# EAGLE board axiom_beta_main_board_v0.29_test (EAGLE 7.0.0), part 1 of 3
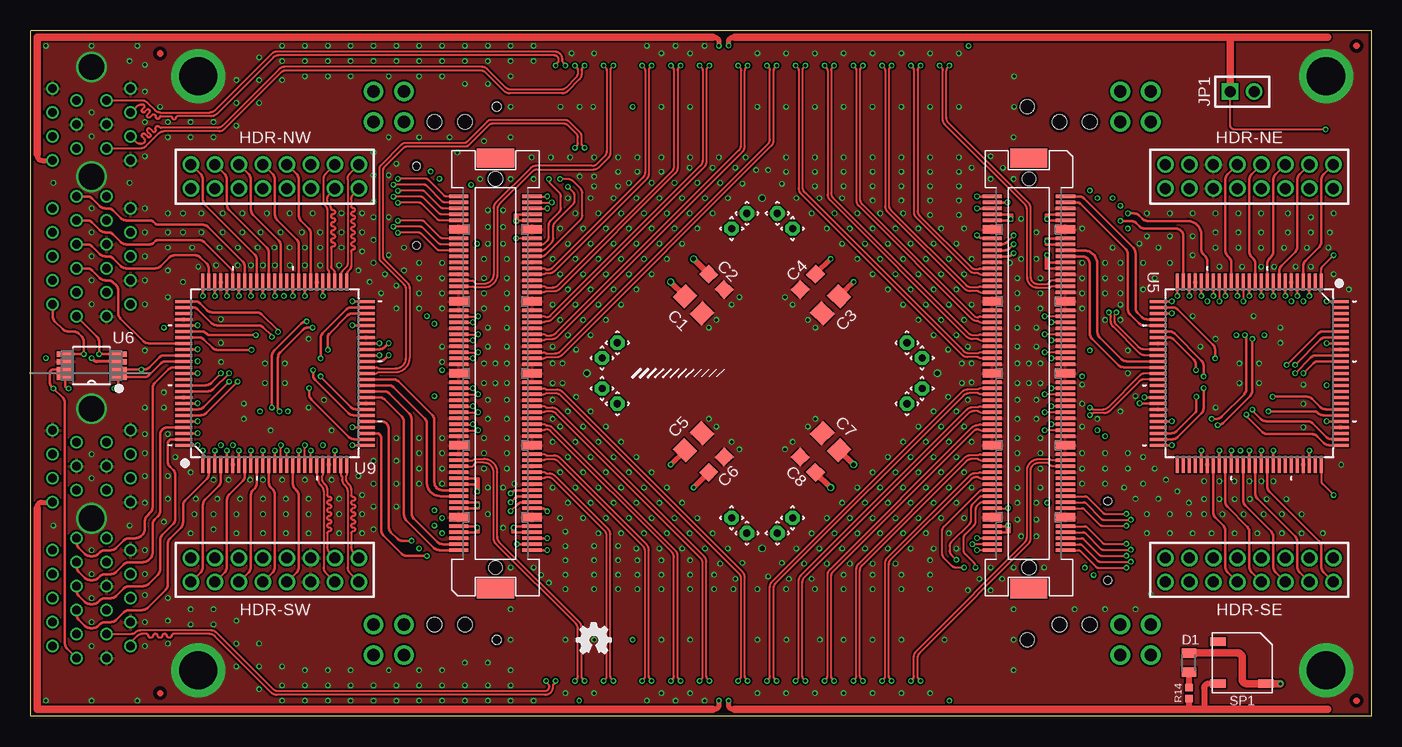
[diagram p6: board, top side]
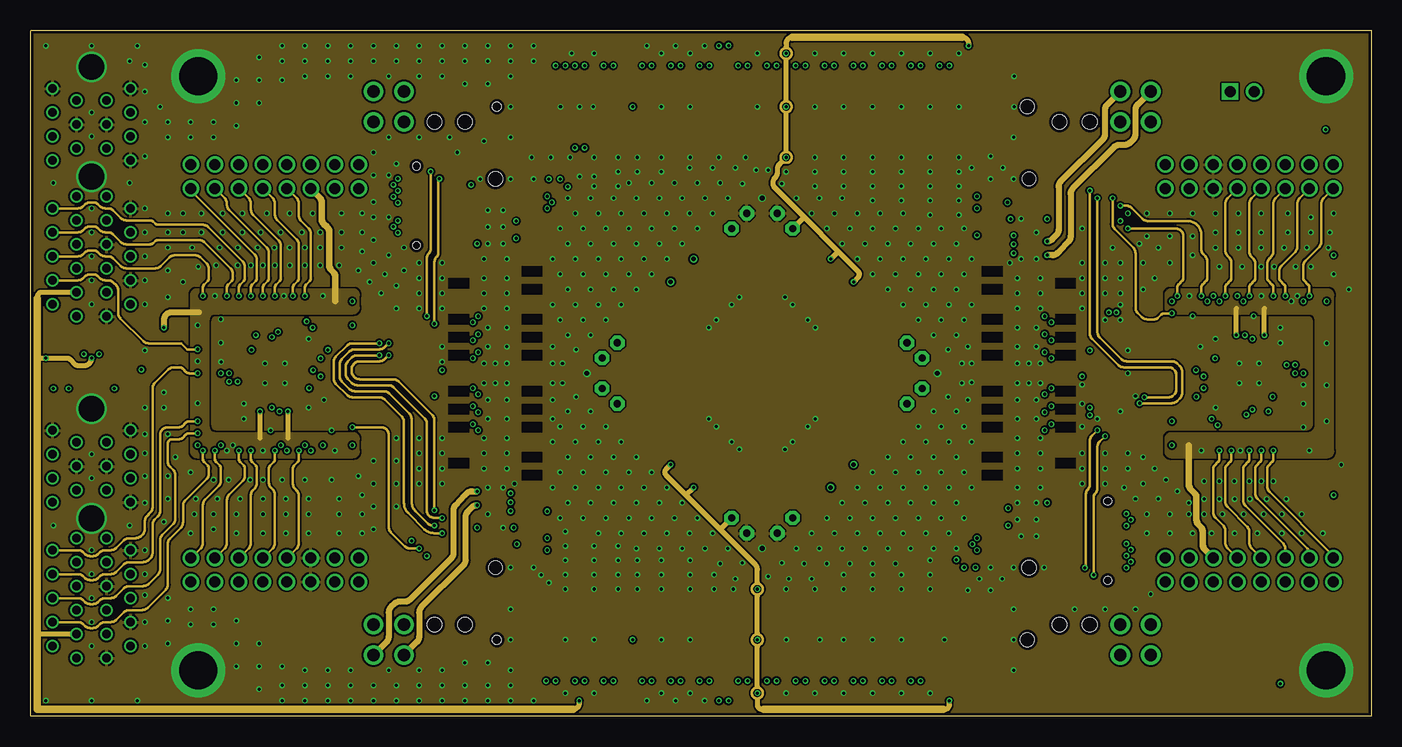
[diagram p7: board, inner layer Route2]
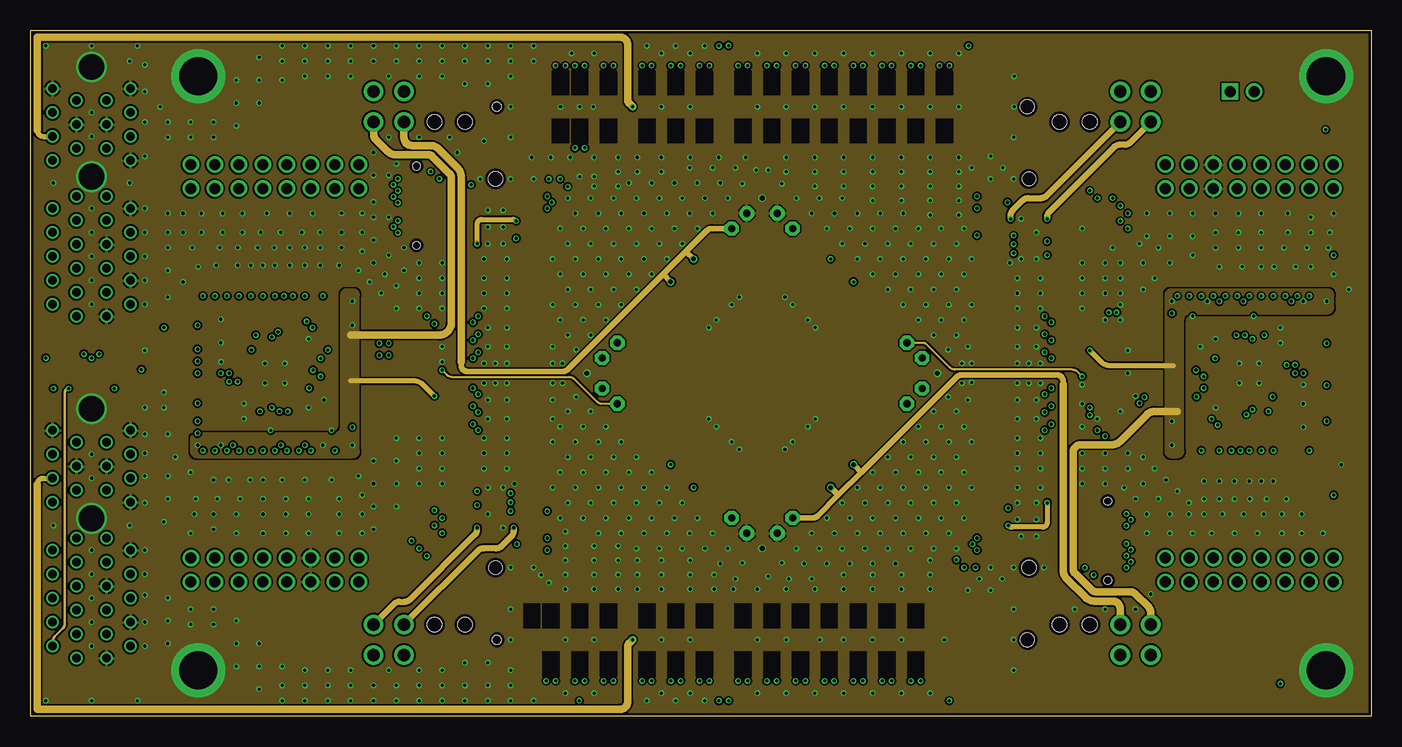
[diagram p8: board, inner layer Route15]
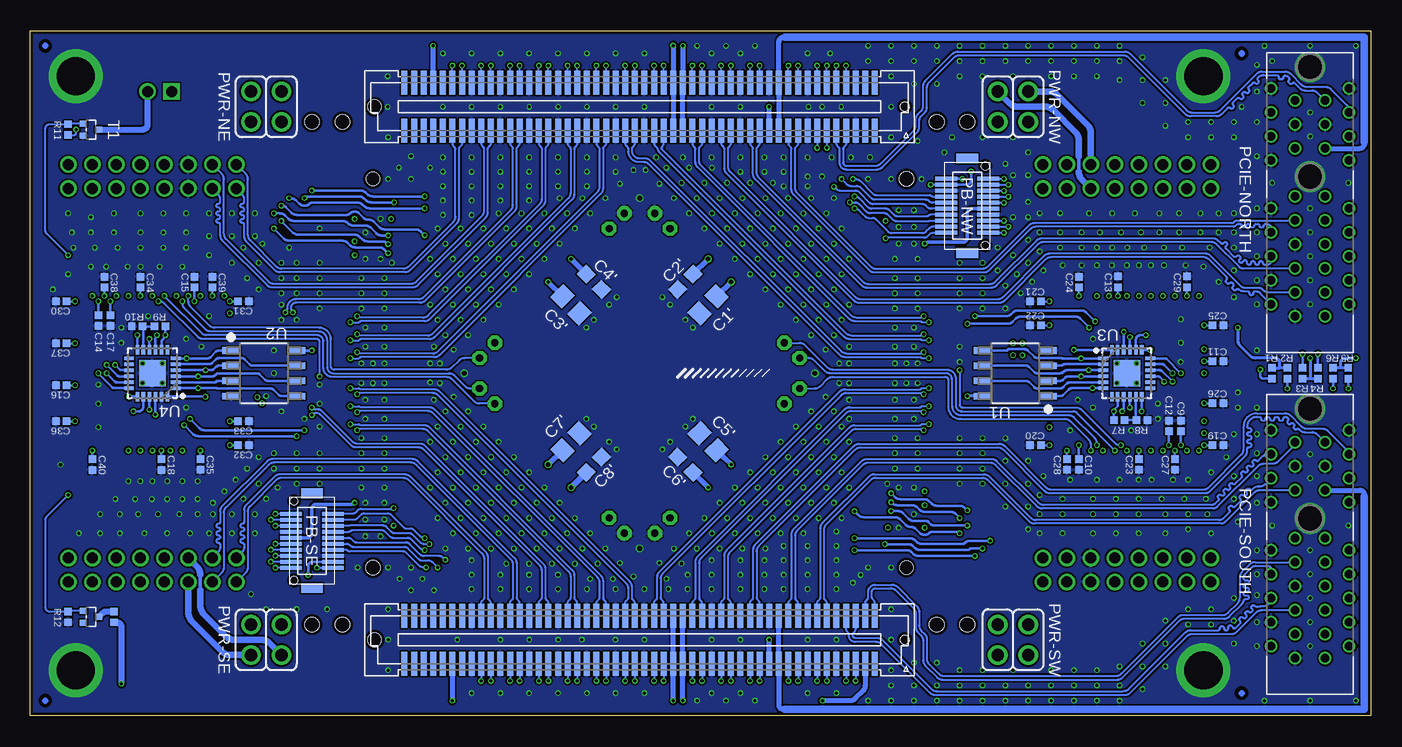
[diagram p9: board, bottom side, seen from below]

Size 111.76 x 57.15 mm. Coordinates in mm from the lower left corner, seen from the top.
Outline: 111.76,57.15 0,57.15 0,0 111.76,0 111.76,57.15
Copper layers (1*2*15*16): Top 0.035559375mm / dielectric 0.17018125mm / Route2 0.01778125mm / dielectric 47mil / Route15 0.01778125mm / dielectric 0.17018125mm / Bottom 0.035559375mm
Design rules "OSHPark-4layer-tuned *": minimum track width 5mil, minimum drill 10mil, track to track 6mil, track to pad 5mil, pad to pad 5mil, via to via 5mil, smd to smd 5mil, copper to edge 10mil, drill to drill 6mil, minimum pad ring 4mil, minimum via ring 4mil, stop-mask expansion 2mil, vias tented up to drill 100mil, thermal gap 6mil
Net classes: 0 default: width 0.152 mm, drill 0.254 mm; 1 power: width 0.152 mm, drill 0.254 mm
Holes 1.2 mm at 33.66,49.53 36.2,49.53 85.72,49.53 88.27,49.53 33.66,7.62 36.2,7.62 85.72,7.62 88.27,7.62
tKeepout: area 105.5,50.8 to 110.5,55.8; area 105.5,1.3 to 110.5,6.3; area 11.5,1.3 to 16.5,6.3; area 11.5,50.8 to 16.5,55.8; area 44.8,12.4 to 77.1,44.7
bKeepout: area 105.5,50.8 to 110.5,55.8; area 105.5,1.3 to 110.5,6.3; area 11.5,1.3 to 16.5,6.3; area 11.5,50.8 to 16.5,55.8
tRestrict: area 10.2,1.3 to 11.4,2.5; area 10.2,54.7 to 11.4,55.8; area 109.9,0.7 to 111,1.8; area 109.9,55.3 to 111,56.4
bRestrict: area 10.2,1.3 to 11.4,2.5; area 10.2,54.7 to 11.4,55.8; area 109.9,0.7 to 111,1.8; area 109.9,55.3 to 111,56.4

## Footprints (pad centres in the part's own frame; a part is rotated, then mirrored left to right if it is on the bottom)
0805-A = smd 1.35 x 1.55: 1 -1,0; 2 1,0
0603-A = smd 1.15 x 1.1: 1 -0.9,0; 2 0.9,0
0402-B = smd 0.62 x 0.62: 1 -0.45,0; 2 0.45,0
MICROMELF-R = smd 0.8 x 1.2: A 0.8,0; C -0.8,0
2X08M = drill 0.914: 1 -7,-1; 2 -7,1; 3 -5,-1; 4 -5,1; 5 -3,-1; 6 -3,1; 7 -1,-1; 8 -1,1; 9 1,-1; 10 1,1; 11 3,-1; 12 3,1; 13 5,-1; 14 5,1; 15 7,-1; 16 7,1
1X02M = drill 0.914 square: 1 -1,0 | drill 0.914: 2 1,0
DF12(XX)-20DP-0.5V = smd 1.8 x 0.35: 1 -1.75,2.25; 2 1.75,2.25; 3 -1.75,1.75; 4 1.75,1.75; 5 -1.75,1.25; 6 1.75,1.25; 7 -1.75,0.75; 8 1.75,0.75; 9 -1.75,0.25; 10 1.75,0.25; 11 -1.75,-0.25; 12 1.75,-0.25; 13 -1.75,-0.75; 14 1.75,-0.75; 15 -1.75,-1.25; 16 1.75,-1.25; 17 -1.75,-1.75; 18 1.75,-1.75; 19 -1.75,-2.25; 20 1.75,-2.25 | smd 1.8 x 0.8: M1 0,3.95; M2 0,-3.95 | hole 0.625: 1.5,-3.3; 1.5,3.3
PCIE-36-NOPEG = drill 0.7: A1 -11.65,1.25; A2 -10.65,3.25; A3 -9.65,1.25; A4 -8.65,3.25; A5 -7.65,1.25; A6 -6.65,3.25; A7 -5.65,1.25; A8 -4.65,3.25; A9 -3.65,1.25; A10 -2.65,3.25; A11 -1.65,1.25; A12 1.35,3.25; A13 2.35,1.25; A14 3.35,3.25; A15 4.35,1.25; A16 5.35,3.25; A17 6.35,1.25; A18 7.35,3.25; B1 -11.65,-1.25; B2 -10.65,-3.25; B3 -9.65,-1.25; B4 -8.65,-3.25; B5 -7.65,-1.25; B6 -6.65,-3.25; B7 -5.65,-1.25; B8 -4.65,-3.25; B9 -3.65,-1.25; B10 -2.65,-3.25; B11 -1.65,-1.25; B12 1.35,-3.25; B13 2.35,-1.25; B14 3.35,-3.25; B15 4.35,-1.25; B16 5.35,-3.25; B17 6.35,-1.25; B18 7.35,-3.25
2X02 = drill 1.016 pad 1.651: 1 -1.27,-1.27; 2 -1.27,1.27; 3 1.27,-1.27; 4 1.27,1.27
KSSG23J12 = smd 1.3 x 0.7: 1 -2,-1.75; 2 2,-1.75; 3 -2,1.75
SOT416 = smd 0.5 x 0.6: 1 -0.5,-0.65; 2 0.5,-0.65; 3 0,0.65
SOIC127P600X175-8N = smd 1.473 x 0.559: 1 -2.718,1.905; 2 -2.718,0.635; 3 -2.718,-0.635; 4 -2.718,-1.905; 5 2.718,-1.905; 6 2.718,-0.635; 7 2.718,0.635; 8 2.718,1.905
QFN50P400X400X80-25N = smd 0.813 x 0.305: 1 -1.956,1.245; 2 -1.956,0.762; 3 -1.956,0.254; 4 -1.956,-0.254; 5 -1.956,-0.762; 6 -1.956,-1.245; 13 1.956,-1.245; 14 1.956,-0.762; 15 1.956,-0.254; 16 1.956,0.254; 17 1.956,0.762; 18 1.956,1.245 | smd 0.305 x 0.813: 7 -1.245,-1.956; 8 -0.762,-1.956; 9 -0.254,-1.956; 10 0.254,-1.956; 11 0.762,-1.956; 12 1.245,-1.956; 19 1.245,1.956; 20 0.762,1.956; 21 0.254,1.956; 22 -0.254,1.956; 23 -0.762,1.956; 24 -1.245,1.956 | smd 2.21 x 2.21: 25 0,0
MACHXO2-100TQFP = smd 1.4 x 0.25: 1 -7.6,6; 2 -7.6,5.5; 3 -7.6,5; 4 -7.6,4.5; 5 -7.6,4; 6 -7.6,3.5; 7 -7.6,3; 8 -7.6,2.5; 9 -7.6,2; 10 -7.6,1.5; 11 -7.6,1; 12 -7.6,0.5; 13 -7.6,0; 14 -7.6,-0.5; 15 -7.6,-1; 16 -7.6,-1.5; 17 -7.6,-2; 18 -7.6,-2.5; 19 -7.6,-3; 20 -7.6,-3.5; 21 -7.6,-4; 22 -7.6,-4.5; 23 -7.6,-5; 24 -7.6,-5.5; 25 -7.6,-6; 51 7.6,-6; 52 7.6,-5.5; 53 7.6,-5; 54 7.6,-4.5; 55 7.6,-4; 56 7.6,-3.5; 57 7.6,-3; 58 7.6,-2.5; 59 7.6,-2; 60 7.6,-1.5; 61 7.6,-1; 62 7.6,-0.5; 63 7.6,0; 64 7.6,0.5; 65 7.6,1; 66 7.6,1.5; 67 7.6,2; 68 7.6,2.5; 69 7.6,3; 70 7.6,3.5; 71 7.6,4; 72 7.6,4.5; 73 7.6,5; 74 7.6,5.5; 75 7.6,6 | smd 0.25 x 1.4: 26 -6,-7.6; 27 -5.5,-7.6; 28 -5,-7.6; 29 -4.5,-7.6; 30 -4,-7.6; 31 -3.5,-7.6; 32 -3,-7.6; 33 -2.5,-7.6; 34 -2,-7.6; 35 -1.5,-7.6; 36 -1,-7.6; 37 -0.5,-7.6; 38 0,-7.6; 39 0.5,-7.6; 40 1,-7.6; 41 1.5,-7.6; 42 2,-7.6; 43 2.5,-7.6; 44 3,-7.6; 45 3.5,-7.6; 46 4,-7.6; 47 4.5,-7.6; 48 5,-7.6; 49 5.5,-7.6; 50 6,-7.6; 76 6,7.6; 77 5.5,7.6; 78 5,7.6; 79 4.5,7.6; 80 4,7.6; 81 3.5,7.6; 82 3,7.6; 83 2.5,7.6; 84 2,7.6; 85 1.5,7.6; 86 1,7.6; 87 0.5,7.6; 88 0,7.6; 89 -0.5,7.6; 90 -1,7.6; 91 -1.5,7.6; 92 -2,7.6; 93 -2.5,7.6; 94 -3,7.6; 95 -3.5,7.6; 96 -4,7.6; 97 -4.5,7.6; 98 -5,7.6; 99 -5.5,7.6; 100 -6,7.6
SOP65P490X110-8N = smd 1.422 x 0.457: 1 -2.21,0.965; 2 -2.21,0.33; 3 -2.21,-0.33; 4 -2.21,-0.965; 5 2.21,-0.965; 6 2.21,-0.33; 7 2.21,0.33; 8 2.21,0.965
1.2/0.6 = drill 0.6 pad 1.2 octagon: 1 0,0
FX10A-100S/10 = smd 0.3 x 1.6: 1 -14.75,3.05; 2 -14.75,-3.05; 3 -14.25,3.05; 4 -14.25,-3.05; 5 -13.75,3.05; 6 -13.75,-3.05; 7 -13.25,3.05; 8 -13.25,-3.05; 9 -12.75,3.05; 10 -12.75,-3.05; 11 -11.25,3.05; 12 -11.25,-3.05; 13 -10.75,3.05; 14 -10.75,-3.05; 15 -10.25,3.05; 16 -10.25,-3.05; 17 -9.75,3.05; 18 -9.75,-3.05; 19 -9.25,3.05; 20 -9.25,-3.05; 21 -8.75,3.05; 22 -8.75,-3.05; 23 -8.25,3.05; 24 -8.25,-3.05; 25 -7.75,3.05; 26 -7.75,-3.05; 27 -7.25,3.05; 28 -7.25,-3.05; 29 -6.75,3.05; 30 -6.75,-3.05; 31 -5.25,3.05; 32 -5.25,-3.05; 33 -4.75,3.05; 34 -4.75,-3.05; 35 -4.25,3.05; 36 -4.25,-3.05; 37 -3.75,3.05; 38 -3.75,-3.05; 39 -3.25,3.05; 40 -3.25,-3.05; 41 -2.75,3.05; 42 -2.75,-3.05; 43 -2.25,3.05; 44 -2.25,-3.05; 45 -1.75,3.05; 46 -1.75,-3.05; 47 -1.25,3.05; 48 -1.25,-3.05; 49 -0.75,3.05; 50 -0.75,-3.05; 51 0.75,3.05; 52 0.75,-3.05; 53 1.25,3.05; 54 1.25,-3.05; 55 1.75,3.05; 56 1.75,-3.05; 57 2.25,3.05; 58 2.25,-3.05; 59 2.75,3.05; 60 2.75,-3.05; 61 3.25,3.05; 62 3.25,-3.05; 63 3.75,3.05; 64 3.75,-3.05; 65 4.25,3.05; 66 4.25,-3.05; 67 4.75,3.05; 68 4.75,-3.05; 69 5.25,3.05; 70 5.25,-3.05; 71 6.75,3.05; 72 6.75,-3.05; 73 7.25,3.05; 74 7.25,-3.05; 75 7.75,3.05; 76 7.75,-3.05; 77 8.25,3.05; 78 8.25,-3.05; 79 8.75,3.05; 80 8.75,-3.05; 81 9.25,3.05; 82 9.25,-3.05; 83 9.75,3.05; 84 9.75,-3.05; 85 10.25,3.05; 86 10.25,-3.05; 87 10.75,3.05; 88 10.75,-3.05; 89 11.25,3.05; 90 11.25,-3.05; 91 12.75,3.05; 92 12.75,-3.05; 93 13.25,3.05; 94 13.25,-3.05; 95 13.75,3.05; 96 13.75,-3.05; 97 14.25,3.05; 98 14.25,-3.05; 99 14.75,3.05; 100 14.75,-3.05 | smd 0.7 x 1.6: G1 -12,3.05; G2 -12,-3.05; G3 -6,3.05; G4 -6,-3.05; G5 0,3.05; G6 0,-3.05; G7 6,3.05; G8 6,-3.05; G9 12,3.05; G10 12,-3.05 | smd 1.6 x 3.1: M1 -17.95,0; M2 17.95,0 | hole 1.1: -16.2,0 | hole 1.2: 16.2,0
µZ-NOHOLES-R = smd 0.5 x 2: 1 19.6,-24.226; 2 19.6,-20.226; 3 18.8,-24.226; 4 18.8,-20.226; 5 18,-24.226; 6 18,-20.226; 7 17.2,-24.226; 8 17.2,-20.226; 9 16.4,-24.226; 10 16.4,-20.226; 11 15.6,-24.226; 12 15.6,-20.226; 13 14.8,-24.226; 14 14.8,-20.226; 15 14,-24.226; 16 14,-20.226; 17 13.2,-24.226; 18 13.2,-20.226; 19 12.4,-24.226; 20 12.4,-20.226; 21 11.6,-24.226; 22 11.6,-20.226; 23 10.8,-24.226; 24 10.8,-20.226; 25 10,-24.226; 26 10,-20.226; 27 9.2,-24.226; 28 9.2,-20.226; 29 8.4,-24.226; 30 8.4,-20.226; 31 7.6,-24.226; 32 7.6,-20.226; 33 6.8,-24.226; 34 6.8,-20.226; 35 6,-24.226; 36 6,-20.226; 37 5.2,-24.226; 38 5.2,-20.226; 39 4.4,-24.226; 40 4.4,-20.226; 41 3.6,-24.226; 42 3.6,-20.226; 43 2.8,-24.226; 44 2.8,-20.226; 45 2,-24.226; 46 2,-20.226; 47 1.2,-24.226; 48 1.2,-20.226; 49 0.4,-24.226; 50 0.4,-20.226; 51 -0.4,-24.226; 52 -0.4,-20.226; 53 -1.2,-24.226; 54 -1.2,-20.226; 55 -2,-24.226; 56 -2,-20.226; 57 -2.8,-24.226; 58 -2.8,-20.226; 59 -3.6,-24.226; 60 -3.6,-20.226; 61 -4.4,-24.226; 62 -4.4,-20.226; 63 -5.2,-24.226; 64 -5.2,-20.226; 65 -6,-24.226; 66 -6,-20.226; 67 -6.8,-24.226; 68 -6.8,-20.226; 69 -7.6,-24.226; 70 -7.6,-20.226; 71 -8.4,-24.226; 72 -8.4,-20.226; 73 -9.2,-24.226; 74 -9.2,-20.226; 75 -10,-24.226; 76 -10,-20.226; 77 -10.8,-24.226; 78 -10.8,-20.226; 79 -11.6,-24.226; 80 -11.6,-20.226; 81 -12.4,-24.226; 82 -12.4,-20.226; 83 -13.2,-24.226; 84 -13.2,-20.226; 85 -14,-24.226; 86 -14,-20.226; 87 -14.8,-24.226; 88 -14.8,-20.226; 89 -15.6,-24.226; 90 -15.6,-20.226; 91 -16.4,-24.226; 92 -16.4,-20.226; 93 -17.2,-24.226; 94 -17.2,-20.226; 95 -18,-24.226; 96 -18,-20.226; 97 -18.8,-24.226; 98 -18.8,-20.226; 99 -19.6,-24.226; 100 -19.6,-20.226; 101 19.6,20.226; 102 19.6,24.226; 103 18.8,20.226; 104 18.8,24.226; 105 18,20.226; 106 18,24.226; 107 17.2,20.226; 108 17.2,24.226; 109 16.4,20.226; 110 16.4,24.226; 111 15.6,20.226; 112 15.6,24.226; 113 14.8,20.226; 114 14.8,24.226; 115 14,20.226; 116 14,24.226; 117 13.2,20.226; 118 13.2,24.226; 119 12.4,20.226; 120 12.4,24.226; 121 11.6,20.226; 122 11.6,24.226; 123 10.8,20.226; 124 10.8,24.226; 125 10,20.226; 126 10,24.226; 127 9.2,20.226; 128 9.2,24.226; 129 8.4,20.226; 130 8.4,24.226; 131 7.6,20.226; 132 7.6,24.226; 133 6.8,20.226; 134 6.8,24.226; 135 6,20.226; 136 6,24.226; 137 5.2,20.226; 138 5.2,24.226; 139 4.4,20.226; 140 4.4,24.226; 141 3.6,20.226; 142 3.6,24.226; 143 2.8,20.226; 144 2.8,24.226; 145 2,20.226; 146 2,24.226; 147 1.2,20.226; 148 1.2,24.226; 149 0.4,20.226; 150 0.4,24.226; 151 -0.4,20.226; 152 -0.4,24.226; 153 -1.2,20.226; 154 -1.2,24.226; 155 -2,20.226; 156 -2,24.226; 157 -2.8,20.226; 158 -2.8,24.226; 159 -3.6,20.226; 160 -3.6,24.226; 161 -4.4,20.226; 162 -4.4,24.226; 163 -5.2,20.226; 164 -5.2,24.226; 165 -6,20.226; 166 -6,24.226; 167 -6.8,20.226; 168 -6.8,24.226; 169 -7.6,20.226; 170 -7.6,24.226; 171 -8.4,20.226; 172 -8.4,24.226; 173 -9.2,20.226; 174 -9.2,24.226; 175 -10,20.226; 176 -10,24.226; 177 -10.8,20.226; 178 -10.8,24.226; 179 -11.6,20.226; 180 -11.6,24.226; 181 -12.4,20.226; 182 -12.4,24.226; 183 -13.2,20.226; 184 -13.2,24.226; 185 -14,20.226; 186 -14,24.226; 187 -14.8,20.226; 188 -14.8,24.226; 189 -15.6,20.226; 190 -15.6,24.226; 191 -16.4,20.226; 192 -16.4,24.226; 193 -17.2,20.226; 194 -17.2,24.226; 195 -18,20.226; 196 -18,24.226; 197 -18.8,20.226; 198 -18.8,24.226; 199 -19.6,20.226; 200 -19.6,24.226 | hole 1.125: 22.1,-22.225; 22.1,22.225 | hole 0.725: -22.1,-22.225; -22.1,22.225

## Placement (x,y rotation side)
C1  [0805-A]  55.25,34.29 315 top
C1'  [0805-A]  55.25,34.29 225 bottom
C2  [0603-A]  57.15,36.2 315 top
C2'  [0603-A]  57.15,36.2 225 bottom
C3  [0805-A]  66.67,34.29 225 top
C3'  [0805-A]  66.67,34.29 315 bottom
C4  [0603-A]  64.77,36.2 225 top
C4'  [0603-A]  64.77,36.2 315 bottom
C5  [0805-A]  55.25,22.86 45 top
C5'  [0805-A]  55.25,22.86 135 bottom
C6  [0603-A]  57.15,20.95 45 top
C6'  [0603-A]  57.15,20.95 135 bottom
C7  [0805-A]  66.67,22.86 135 top
C7'  [0805-A]  66.67,22.86 45 bottom
C8  [0603-A]  64.77,20.95 135 top
C8'  [0603-A]  64.77,20.95 45 bottom
C9  100n  [0402-B]  15.86,24.17 90 bottom
C10  100n  [0402-B]  24.36,20.98 270 bottom
C11  100n  [0402-B]  12.76,29.57 0 bottom
C12  100n  [0402-B]  16.86,24.17 90 bottom
C13  100n  [0402-B]  21.11,36.2 90 bottom
C14  100n  [0402-B]  106.06,32.98 270 bottom
C15  100n  [0402-B]  98.06,36.17 90 bottom
C16  100n  [0402-B]  109.16,27.57 180 bottom
C17  100n  [0402-B]  105.06,32.98 270 bottom
C18  100n  [0402-B]  100.81,20.95 270 bottom
C19  10n  [0402-B]  12.76,22.57 0 bottom
C20  10n  [0402-B]  27.96,22.57 180 bottom
C21  10n  [0402-B]  27.96,34.58 180 bottom
C22  10n  [0402-B]  27.96,32.58 180 bottom
C23  10n  [0402-B]  19.36,20.98 270 bottom
C24  10n  [0402-B]  24.36,36.18 90 bottom
C25  10n  [0402-B]  12.76,32.58 0 bottom
C26  10n  [0402-B]  12.76,26.07 0 bottom
C27  10n  [0402-B]  16.36,20.98 270 bottom
C28  10n  [0402-B]  25.36,20.98 270 bottom
C29  10n  [0402-B]  15.36,36.2 90 bottom
C30  10n  [0402-B]  109.16,34.58 180 bottom
C31  10n  [0402-B]  93.96,34.58 0 bottom
C32  10n  [0402-B]  93.96,22.57 0 bottom
C33  10n  [0402-B]  93.96,24.57 0 bottom
C34  10n  [0402-B]  102.56,36.17 90 bottom
C35  10n  [0402-B]  97.56,20.97 270 bottom
C36  10n  [0402-B]  109.16,24.57 180 bottom
C37  10n  [0402-B]  109.16,31.07 180 bottom
C38  10n  [0402-B]  105.56,36.17 90 bottom
C39  10n  [0402-B]  96.56,36.17 90 bottom
C40  10n  [0402-B]  106.56,20.95 270 bottom
D1  [MICROMELF-R]  96.52,4.45 90 top
HDR-NE  [2X08M]  101.56,44.97 180 top
HDR-NW  [2X08M]  20.36,44.97 0 top
HDR-SE  [2X08M]  101.56,12.18 180 top
HDR-SW  [2X08M]  20.36,12.18 0 top
JP1  [1X02M]  100.97,52.07 0 top
LOGO1  OSHW_LOGO_FILLX0100-NT  [OSHW_FILLX100_NOTEXT]  45.52,5.21 0 top
PB-NW  DF12(XX)-20DP-0.5V  [DF12(XX)-20DP-0.5V]  33.66,42.55 0 bottom
PB-SE  DF12(XX)-20DP-0.5V  [DF12(XX)-20DP-0.5V]  88.27,14.6 180 bottom
PCIE-NORTH  PCIE-36-AXIOM-NOPEG  [PCIE-36-NOPEG]  5.08,44.97 90 bottom
PCIE-SOUTH  PCIE-36-AXIOM-NOPEG  [PCIE-36-NOPEG]  5.08,16.48 90 bottom
PWR-NE  PINHD-2X02_2.54  [2X02]  92.08,50.8 180 bottom
PWR-NW  PINHD-2X02_2.54  [2X02]  29.85,50.8 0 bottom
PWR-SE  PINHD-2X02_2.54  [2X02]  92.08,6.35 180 bottom
PWR-SW  PINHD-2X02_2.54  [2X02]  29.85,6.35 0 bottom
R1  [0402-B]  8.26,28.57 270 bottom
R2  [0402-B]  6.98,28.57 270 bottom
R3  [0402-B]  5.72,28.57 90 bottom
R4  [0402-B]  4.45,28.57 90 bottom
R5  [0402-B]  1.91,28.57 270 bottom
R6  [0402-B]  3.18,28.57 270 bottom
R7  [0402-B]  20.99,24.66 0 bottom
R8  [0402-B]  19.09,24.66 0 bottom
R9  [0402-B]  100.93,32.49 180 bottom
R10  [0402-B]  102.83,32.49 180 bottom
R11  [0402-B]  108.59,48.89 90 bottom
R12  [0402-B]  108.59,8.25 90 bottom
R13  [0402-B]  104.78,8.25 270 bottom
R14  [0402-B]  96.52,1.9 270 top
SP1  KSSG23J12  [KSSG23J12]  100.97,4.45 0 top
T1  NX3008NBKT  [SOT416]  106.68,48.89 270 bottom
T2  NX3008NBKT  [SOT416]  106.68,8.25 270 bottom
U1  SST25VF020B  [SOIC127P600X175-8N]  29.65,28.57 180 bottom
U2  SST25VF020B  [SOIC127P600X175-8N]  92.27,28.57 0 bottom
U3  [QFN50P400X400X80-25N]  20.36,28.57 0 bottom
U4  [QFN50P400X400X80-25N]  101.56,28.57 180 bottom
U5  MACHXO2-100  [MACHXO2-100TQFP]  101.56,28.57 270 top
U6  PCA9540BDP  [SOP65P490X110-8N]  5.08,29.21 180 top
U9  MACHXO2-100  [MACHXO2-100TQFP]  20.36,28.57 90 top
U$1  PINPAD1.27MM  [1.2/0.6]  47.62,29.84 45 top
U$2  PINPAD1.27MM  [1.2/0.6]  47.62,27.3 45 top
U$3  PINPAD1.27MM  [1.2/0.6]  73.03,31.11 45 top
U$4  PINPAD1.27MM  [1.2/0.6]  48.9,26.04 225 top
U$5  PINPAD1.27MM  [1.2/0.6]  62.23,15.24 45 top
U$6  PINPAD1.27MM  [1.2/0.6]  62.23,41.91 45 top
U$11  PINPAD1.27MM  [1.2/0.6]  48.9,31.11 45 top
U$14  PINPAD1.27MM  [1.2/0.6]  74.3,27.3 45 top
U$15  PINPAD1.27MM  [1.2/0.6]  74.3,29.84 45 top
U$16  PINPAD1.27MM  [1.2/0.6]  73.03,26.04 45 top
U$17  PINPAD1.27MM  [1.2/0.6]  59.69,41.91 45 top
U$18  PINPAD1.27MM  [1.2/0.6]  58.42,40.64 45 top
U$19  PINPAD1.27MM  [1.2/0.6]  63.5,40.64 45 top
U$20  PINPAD1.27MM  [1.2/0.6]  59.69,15.24 45 top
U$21  PINPAD1.27MM  [1.2/0.6]  63.5,16.51 45 top
U$22  PINPAD1.27MM  [1.2/0.6]  58.42,16.51 45 top
X-EAST  FX10-100/10S  [FX10A-100S/10]  83.19,28.57 270 top
X-WEST  FX10-100/10S  [FX10A-100S/10]  38.73,28.57 90 top
ZED1  µZ-FCI-NOHOLES-R  [µZ-NOHOLES-R]  60.96,28.57 180 bottom

## Tracks (layer width: path | path; a pad name or v marks a point on that pad's centre or on a via)
!HOLD!_E
  Bottom 0.203: U2.7 93.19,29.21 arc45 93.46,29.32 93.87,29.73 arc-45 94.14,29.84 96,29.84 arc-45 96.27,29.73 96.56,29.45 arc45 96.83,29.34 U4.5
!HOLD!_W
  Bottom 0.203: U1.7 28.77,27.94 arc45 28.5,27.83 28.09,27.42 arc-45 27.82,27.3 25.91,27.3 arc-45 25.65,27.42 25.36,27.7 arc45 25.09,27.81 U3.5
!WP!_E
  Bottom 0.203: U2.3 96.09,27.94 arc-45 96.22,27.89 arc45 96.4,27.81 U4.2
!WP!_W
  Bottom 0.203: U1.3 25.83,29.21 arc-45 25.7,29.26 arc45 25.52,29.34 U3.2
A_SCL  (via drill 0.25)
  Top 0.203: v23.49,32.38 23.12,32.38 arc45 22.67,32.2 20.8,30.32 arc45 20.61,29.88 20.61,25.71 arc45 v20.74,25.4
  Route2 0.203: v34.07,44.8 arc45 33.97,44.55 33.97,38.6 arc-45 33.84,38.29 arc45 33.66,37.84 v33.66,32.7
  Bottom 0.203: U3.9 20.61,25.71 arc45 v20.74,25.4 | PB-NW.1 v34.07,44.8 | v33.66,32.7 30.3,32.7 arc-45 29.85,32.89 29.6,33.14 arc45 29.15,33.33 24.7,33.33 arc45 24.25,33.14 v23.49,32.38
A_SDA  (via drill 0.25)
  Top 0.203: v23,32.89 arc45 22.55,32.71 20.29,30.45 arc45 20.11,30 v20.11,25.72
  Route2 0.203: v33.34,45.4 33.34,38.92 arc-45 33.21,38.6 arc45 33.02,38.15 v33.02,33.34
  Bottom 0.203: U3.10 v20.11,25.72 | v36.7,44.3 PB-NW.3 33.72,44.3 arc-90 33.34,44.68 v33.34,45.4 | v33.02,33.34 30.43,33.34 arc-45 29.98,33.52 29.86,33.64 arc45 29.41,33.83 24.19,33.83 arc45 23.74,33.64 v23,32.89
B_SCL  (via drill 0.25)
  Top 0.203: v98.43,24.77 98.8,24.77 arc45 99.25,24.95 101.12,26.82 arc45 101.31,27.27 101.31,31.44 arc45 v101.18,31.75
  Route2 0.203: v87.85,12.36 arc45 87.95,12.59 87.95,18.55 arc-45 88.08,18.86 arc45 88.27,19.31 88.27,22.93 arc-45 88.45,23.38 v88.9,23.82
  Bottom 0.203: U4.9 101.31,31.44 arc45 v101.18,31.75 | PB-SE.1 v87.85,12.36 | v88.9,23.82 97.22,23.82 arc45 97.67,24.01 v98.43,24.77
B_SDA  (via drill 0.25)
  Top 0.203: v98.92,24.26 arc45 99.37,24.44 101.63,26.7 arc45 101.81,27.15 v101.81,31.43
  Route2 0.203: v88.58,11.75 88.58,18.23 arc-45 88.71,18.55 arc45 88.9,19 88.9,22.23 88.9,22.43 arc-45 89.09,22.88 v89.53,23.32
  Bottom 0.203: U4.10 v101.81,31.43 | PB-SE.3 88.2,12.85 arc-90 88.58,12.47 v88.58,11.75 | v89.53,23.32 97.73,23.32 arc45 98.18,23.51 v98.92,24.26
BANK13_00_N  (via drill 0.25)
  Top 0.152: v45.36,54.23 45.5,54.09 arc-45 45.61,53.82 45.61,53.66 arc-45 45.42,53.21 44.62,52.41 arc-45 44.17,52.22 40.04,52.22 arc-45 39.59,52.41 38.06,53.94 arc45 37.61,54.13 21.16,54.13 arc45 20.71,53.94 16.01,49.23 arc-45 15.56,49.05 10.85,49.05 arc-45 10.73,49.12 | PCIE-NORTH.A14 8.71,47.94 arc90 9.46,47.79 arc90 9.46,48.14 9.3,48.3 arc-90 9.3,48.51 9.3,48.52 arc-90 9.52,48.52 9.74,48.29 arc90 9.96,48.29 9.96,48.3 arc90 9.96,48.51 9.74,48.74 arc-90 9.74,48.95 9.74,48.96 arc-90 9.96,48.96 10.17,48.74 arc83 10.38,48.73 arc76 10.41,48.92 arc-35 10.39,49 arc-90 10.55,49.17 10.59,49.17 arc-45 10.73,49.12 | 10.73,49.12
  Bottom 0.152: ZED1.89 v45.36,54.23
BANK13_00_P  (via drill 0.25)
  Top 0.152: v46.16,54.23 46.02,54.09 arc45 45.91,53.82 45.91,53.53 arc-45 45.73,53.08 44.75,52.1 arc-45 44.3,51.92 39.92,51.92 arc-45 39.47,52.1 37.94,53.64 arc45 37.49,53.82 21.29,53.82 arc45 20.84,53.64 16.13,48.93 arc-45 15.68,48.74 11.11,48.74 arc45 10.66,48.56 9.61,47.51 arc-45 9.16,47.33 PCIE-NORTH.A13
  Bottom 0.152: ZED1.87 v46.16,54.23
BANK13_01_N  (via drill 0.25)
  Top 0.152: v45.36,47.37 45.5,47.51 arc45 45.61,47.78 45.61,48.25 arc45 45.5,48.52 44.75,49.27 arc45 44.48,49.38 38.45,49.38 arc45 38.18,49.27 36.5,47.58 arc-45 36.23,47.47 31.34,47.47 arc45 31.07,47.36 29.47,45.77 arc45 29.36,45.5 29.36,38.32 arc45 29.47,38.05 31.4,36.13 arc-45 31.59,35.68 31.59,29.84 arc-90 30.41,28.67 29.01,28.67 arc45 28.92,28.63 28.9,28.61 arc-45 28.81,28.57 U9.38
  Bottom 0.152: ZED1.90 v45.36,47.37
BANK13_01_P  (via drill 0.25)
  Top 0.152: v46.16,47.37 46.02,47.51 arc-45 45.91,47.78 45.91,48.38 arc45 45.8,48.65 44.88,49.57 arc45 44.61,49.68 38.32,49.68 arc45 38.05,49.57 36.37,47.89 arc-45 36.1,47.78 31.21,47.78 arc45 30.94,47.67 29.17,45.89 arc45 29.06,45.62 29.06,38.2 arc45 29.17,37.92 31.09,36 arc-45 31.28,35.55 31.28,29.84 arc-90 30.41,28.98 29.01,28.98 arc-45 28.92,29.02 28.9,29.04 arc45 28.81,29.07 U9.39
  Bottom 0.152: ZED1.88 v46.16,47.37
BANK13_02_N  (via drill 0.25)
  Top 0.152: v43.76,54.23 arc-45 43.83,54.4 43.93,54.5 arc45 44.01,54.68 44.01,54.71 arc90 43.63,55.09 20.65,55.09 arc45 20.2,54.91 15.5,50.2 arc-45 15.05,50.01 12.24,50.01 arc90 12.11,49.88 12.11,49.88 arc-90 11.96,49.75 11.92,49.75 arc-90 11.79,49.88 11.79,49.88 arc85 11.64,50.01 10.88,50.01 arc85 10.75,49.91 arc-90 10.61,49.8 10.6,49.8 arc-100 10.43,49.96 arc80 10.35,50.13 arc80 10.12,50.1 9.96,49.94 arc-90 9.74,49.94 9.74,49.94 arc-90 9.74,50.15 9.9,50.32 arc90 9.9,50.53 9.9,50.53 arc90 9.69,50.53 9.52,50.37 arc-90 9.31,50.37 9.31,50.37 arc-90 9.31,50.59 9.47,50.75 arc135 9.35,50.97 9.23,50.97 arc45 8.79,50.78 PCIE-NORTH.A16
  Bottom 0.152: ZED1.93 v43.76,54.23
BANK13_02_P  (via drill 0.25)
  Top 0.152: v44.56,54.23 arc45 44.49,54.4 44.39,54.5 arc-45 44.31,54.68 44.31,54.76 arc90 43.68,55.4 20.53,55.4 arc45 20.08,55.21 15.37,50.5 arc-45 14.92,50.32 10.81,50.32 arc-45 10.37,50.5 9.73,51.14 arc45 9.28,51.33 PCIE-NORTH.A17
  Bottom 0.152: ZED1.91 v44.56,54.23
BANK13_03_N
  Bottom 0.152: ZED1.94 43.76,47.71 arc45 43.83,47.53 43.93,47.43 arc-45 44,47.25 44,46.15 arc-90 43.72,45.87 41.31,45.87 arc-45 40.86,46.06 38.15,48.77 arc-45 37.97,49.22 37.97,49.71 arc45 37.78,50.16 37.52,50.42 arc-45 37.33,50.87 37.33,52.5 arc45 37.14,52.95 34.89,55.21 arc45 34.44,55.4 20.53,55.4 arc45 20.08,55.21 15.37,50.5 arc-45 14.92,50.32 13.03,50.32 arc-45 12.58,50.5 9.54,53.54 arc45 9.09,53.73 7.16,53.73 arc45 6.71,53.54 5.81,52.64 arc-45 5.36,52.46 3.8,52.46 arc45 3.36,52.27 2.02,50.93 arc45 1.83,50.48 PCIE-NORTH.B16
BANK13_03_P
  Bottom 0.152: ZED1.92 44.56,47.71 arc-45 44.49,47.53 44.38,47.43 arc45 44.31,47.25 44.31,46.15 arc-90 43.72,45.57 41.19,45.57 arc-45 40.74,45.75 37.85,48.65 arc-45 37.66,49.09 37.66,49.59 arc45 37.47,50.03 37.21,50.3 arc-45 37.03,50.75 37.03,52.38 arc45 36.84,52.83 34.76,54.91 arc45 34.31,55.09 20.65,55.09 arc45 20.2,54.91 15.5,50.2 arc-45 15.05,50.01 12.9,50.01 arc-45 12.45,50.2 11.95,50.7 arc90 11.74,50.7 11.73,50.69 arc-90 11.51,50.69 11.48,50.72 arc-90 11.48,50.93 11.49,50.94 arc90 11.49,51.16 11.15,51.5 arc90 10.94,51.5 10.93,51.49 arc-90 10.71,51.49 10.68,51.52 arc-90 10.68,51.73 10.69,51.75 arc90 10.69,51.96 10.66,51.99 arc90 10.44,51.99 10.43,51.98 arc-90 10.21,51.98 10.18,52.01 arc-90 10.18,52.23 10.19,52.24 arc90 10.19,52.46 9.88,52.77 arc90 9.66,52.77 9.65,52.76 arc-90 9.44,52.76 9.41,52.79 arc-90 9.41,53 9.42,53.02 arc90 9.42,53.23 9.41,53.24 arc45 8.96,53.42 7.86,53.42 arc90 7.71,53.27 7.71,53.23 arc-90 7.56,53.08 7.46,53.08 arc-90 7.31,53.23 7.31,53.25 arc90 7.16,53.4 arc45 6.88,53.26 arc80 6.84,53.02 6.85,53.01 arc-90 6.85,52.79 6.79,52.73 arc-90 6.57,52.73 6.56,52.75 arc90 6.35,52.75 6.03,52.43 | 6.03,52.43 5.94,52.34 arc-45 5.49,52.15 4.92,52.15 arc45 4.47,51.97 PCIE-NORTH.B17 | 6.03,52.43 arc-63 6.03,52.43
BANK13_04_N
  Bottom 0.152: PCIE-SOUTH.A6 arc90 9,9.16 arc-20 9.43,9.11 arc45 9.7,9.2 arc-90 9.91,9.2 9.95,9.16 arc-90 9.95,8.95 9.92,8.93 arc90 9.92,8.71 9.95,8.68 arc90 10.17,8.68 10.19,8.7 arc-90 10.41,8.7 10.44,8.67 arc-90 10.44,8.45 10.42,8.43 arc90 10.42,8.21 10.45,8.18 arc90 10.66,8.18 10.69,8.21 arc-90 10.9,8.21 10.94,8.17 arc-90 10.94,7.93 arc-45 10.94,7.93 10.92,7.92 arc90 10.92,7.71 11.29,7.34 arc90 11.5,7.34 11.53,7.37 11.55,7.4 arc-70 11.7,7.56 11.75,7.56 arc-90 11.9,7.4 11.9,7.29 arc90 12.06,7.14 12.1,7.14 arc90 12.26,7.29 12.26,7.33 arc-90 12.41,7.48 12.45,7.48 arc-90 12.61,7.33 12.61,7.29 arc90 12.76,7.14 15.04,7.14 arc-45 15.49,6.95 20.2,2.24 arc45 20.65,2.06 36.19,2.06 arc45 36.64,2.24 40.68,6.29 arc-45 41.13,6.48 42.95,6.48 arc90 43.21,6.73 arc45 43.11,6.98 43.07,7.01 arc-45 42.96,7.28 ZED1.195
BANK13_04_P
  Bottom 0.152: PCIE-SOUTH.A5 9.11,8.82 arc-45 9.56,8.64 11.18,7.02 arc45 11.63,6.83 14.91,6.83 arc-45 15.36,6.65 20.07,1.94 arc45 20.52,1.75 36.31,1.75 arc45 36.76,1.94 40.81,5.99 arc-45 41.26,6.17 43,6.17 arc90 43.51,6.68 43.51,6.72 arc-45 43.62,6.99 43.65,7.01 arc45 43.76,7.28 ZED1.193
BANK13_05_N  (via drill 0.25)
  Top 0.152: v42.96,2.92 arc45 43.03,2.75 43.13,2.65 arc-45 43.21,2.47 43.21,2.44 arc-90 42.83,2.06 20.65,2.06 arc-45 20.2,2.24 15.49,6.95 arc45 15.04,7.14 9.16,7.14 arc45 8.71,6.95 arc-45 8.4,6.82 PCIE-SOUTH.A3
  Bottom 0.152: ZED1.196 v42.96,2.92
BANK13_05_P  (via drill 0.25)
  Top 0.152: v43.76,2.92 arc-45 43.69,2.75 43.59,2.65 arc45 43.51,2.47 43.51,2.39 arc-90 42.88,1.75 20.52,1.75 arc-45 20.07,1.94 15.36,6.65 arc45 14.91,6.83 11.9,6.83 arc90 11.74,6.68 11.74,6.68 arc-90 11.59,6.52 11.51,6.52 arc-90 11.36,6.68 11.36,6.68 arc90 11.2,6.83 11.12,6.83 arc90 10.97,6.68 10.97,6.68 arc-90 10.82,6.52 10.74,6.52 arc-90 10.59,6.68 10.59,6.68 arc90 10.43,6.83 10.35,6.83 arc90 10.2,6.68 10.2,6.68 arc-90 10.05,6.52 9.97,6.52 arc-90 9.81,6.68 9.81,6.68 arc90 9.66,6.83 9.29,6.83 arc45 8.89,6.67 8.52,6.29 arc45 8.33,5.84 PCIE-SOUTH.A2
  Bottom 0.152: ZED1.194 v43.76,2.92
BANK13_06_N
  Bottom 0.152: ZED1.199 41.36,9.44 arc-45 41.43,9.62 41.53,9.72 arc45 41.6,9.9 41.6,10.36 arc90 41.32,10.64 40.04,10.64 arc45 39.59,10.46 38.15,9.01 arc45 37.97,8.56 37.97,7.44 arc-45 37.78,6.99 37.52,6.73 arc45 37.33,6.28 37.33,4.64 arc-45 37.14,4.2 36.16,3.21 arc-45 35.71,3.02 21.16,3.02 arc-45 20.71,3.21 16,7.92 arc45 15.55,8.1 12.27,8.1 arc-45 11.82,8.29 10.83,9.28 arc-30 10.64,9.57 arc60 10.49,9.72 10.34,9.72 arc-90 10.18,9.88 10.18,9.89 arc-90 10.34,10.04 10.49,10.04 arc90 10.64,10.2 10.64,10.21 arc90 10.49,10.36 10.34,10.36 arc-90 10.18,10.52 10.18,10.53 arc-90 10.34,10.69 10.49,10.69 arc90 10.64,10.84 10.64,10.85 arc90 10.49,11 10.34,11 arc-90 10.18,11.15 10.18,11.17 arc-90 10.34,11.32 10.49,11.32 arc90 10.64,11.47 arc45 10.49,11.83 9.98,12.35 arc45 9.62,12.5 8.58,12.5 arc90 8.33,12.25 PCIE-SOUTH.A8
BANK13_06_P
  Bottom 0.152: ZED1.197 42.16,9.44 arc45 42.09,9.62 41.98,9.72 arc-45 41.91,9.9 41.91,10.36 arc90 41.32,10.95 39.92,10.95 arc45 39.47,10.76 37.85,9.14 arc45 37.66,8.69 37.66,7.56 arc-45 37.47,7.12 37.21,6.85 arc45 37.03,6.4 37.03,4.77 arc-45 36.84,4.32 36.03,3.51 arc-45 35.58,3.33 21.28,3.33 arc-45 20.83,3.51 16.12,8.22 arc45 15.68,8.41 12.39,8.41 arc-45 11.94,8.59 11.13,9.4 arc-45 10.95,9.85 10.95,11.55 arc45 10.76,12 10.12,12.64 arc45 9.67,12.82 PCIE-SOUTH.A9
C_CK_E  (via drill 0.25)
  Top 0.152: U5.18 v99.06,34.58
  Bottom 0.152: 99.06,34.43 arc-45 98.87,33.98 97.15,32.25 arc-45 96.7,32.07 87.76,32.07 arc90 87,31.31 87,29.08 arc-90 86.49,28.57 76.84,28.57 arc45 76.39,28.39 75.5,27.49 arc-45 75.05,27.3 U$14.1
  Bottom 0.203: 99.06,34.43 v99.06,34.58
C_CK_W  (via drill 0.25)
  Top 0.152: U9.18 v22.86,22.57
  Bottom 0.152: 22.86,22.72 arc-45 23.05,23.17 24.77,24.9 arc-45 25.22,25.08 34.16,25.08 arc90 34.92,25.84 34.92,28.07 arc-90 35.43,28.57 45.08,28.57 arc45 45.52,28.76 46.42,29.66 arc-45 46.87,29.84 U$1.1
  Bottom 0.203: 22.86,22.72 v22.86,22.57
C_EN_E  (via drill 0.25)
  Top 0.152: U5.14 v101.06,34.58
  Route15 0.152: U$3.1 74.29,31.11 arc-45 74.73,30.93 76.6,29.07 arc45 77.05,28.88 86.81,28.88 arc-45 87.26,28.69 v87.63,28.32
  Bottom 0.152: v87.63,28.32 87.63,31.18 arc-90 87.88,31.43 97.34,31.43 arc45 97.78,31.62 100.56,34.39 arc-45 101,34.58 v101.06,34.58
C_EN_W  (via drill 0.25)
  Top 0.152: U9.14 v20.86,22.57
  Route15 0.152: U$4.1 47.63,26.04 arc-45 47.19,26.22 45.32,28.08 arc45 44.87,28.27 35.11,28.27 arc-45 34.66,28.46 v34.29,28.83
  Bottom 0.152: v34.29,28.83 34.29,25.97 arc-90 34.04,25.72 24.58,25.72 arc45 24.13,25.53 21.36,22.76 arc-45 20.91,22.57 v20.86,22.57
C_SI_E  (via drill 0.25)
  Top 0.152: U5.19 v98.56,35.02
  Bottom 0.152: 98.56,34.56 v98.56,35.02 98.56,34.56 | U$15.1 75.56,29.84 arc-45 76,29.66 76.6,29.07 arc45 77.05,28.88 86.42,28.88 arc90 86.68,29.13 86.68,31.37 arc-90 87.69,32.38 96.38,32.38 arc45 96.83,32.57 98.37,34.11 arc45 98.56,34.56
C_SI_W  (via drill 0.25)
  Top 0.152: U9.19 v23.36,22.12
  Bottom 0.152: U$2.1 46.36,27.3 arc-45 45.91,27.49 45.32,28.08 arc45 44.87,28.27 35.5,28.27 arc90 35.24,28.02 35.24,25.78 arc-90 34.23,24.77 25.54,24.77 arc45 25.09,24.58 23.55,23.04 arc45 23.36,22.59 v23.36,22.12
C_SO_E  (via drill 0.25)
  Top 0.152: U5.15 v100.56,35.02
  Bottom 0.152: U$16.1 74.29,26.04 arc45 74.73,26.22 76.6,28.08 arc-45 77.05,28.27 86.55,28.27 arc90 87.31,29.03 87.31,31.24 arc-90 87.82,31.75 97.11,31.75 arc45 97.41,31.87 v100.56,35.02
C_SO_W  (via drill 0.25)
  Top 0.152: U9.15 v21.36,22.12
  Bottom 0.152: U$11.1 47.63,31.11 arc45 47.19,30.93 45.32,29.07 arc-45 44.87,28.88 35.37,28.88 arc90 34.61,28.12 34.61,25.91 arc-90 34.1,25.4 24.81,25.4 arc45 24.51,25.28 v21.36,22.12
CSO_NE_V  (via drill 0.25, 0.25 pad 0.25)
  Top 0.406: v66.67,38.1 C4.1 | v68.58,36.2 arc-63 v68.58,36.2 | v68.58,36.2 68.02,35.63 C3'.1
  Route2 0.152: 62.96,46.12 arc30 62.56,46.18
  Route2 0.203: 62.96,47.03 arc-180 62.96,46.12 arc-180 62.96,47.03 | 62.96,50.34 arc180 62.96,51.26 | 62.96,51.26 arc180 62.96,50.34 | 62.96,54.79 arc180 62.96,55.7 | 62.96,55.7 arc180 62.96,54.79 | 62.96,47.03 62.96,47.13 | 62.96,50.24 62.96,50.34 | 62.96,51.26 62.96,51.36 | 62.96,54.79 62.96,54.69 | 62.96,55.7 62.96,55.8
  Route2 0.406: 62.96,51.36 62.96,54.69 | 62.96,47.13 62.96,50.24 | 62.56,46.18 62.42,46.03 arc45 62.23,45.58 62.23,45.35 arc-45 62.04,44.9 arc90 62.04,44 64.45,41.59 | 64.45,41.59 67.31,38.73 | 67.31,38.73 68.95,37.1 arc-90 68.95,36.56 v68.58,36.2 | 67.31,38.73 v66.67,38.1 | U$19.1 64.45,41.59 | 63.47,56.59 arc90 62.96,56.08 62.96,55.8 | 77.65,56.59 arc-90 78.16,56.08 v78.16,55.88
  Route2 0.61: 77.65,56.59 63.47,56.59
  Bottom 0.406: v66.67,38.1 arc-63 v66.67,38.1 | v66.67,38.1 C4.1 | v68.58,36.2 arc-63 v68.58,36.2 | v68.58,36.2 C3'.1 | ZED1.7 v78.16,55.88
CSO_NW_V  (via drill 0.38)
  Top 0.508: C1.1 v53.34,36.2 | C2.1 v55.25,38.1
  Route15 0.457: 52.7,36.83 44.79,28.91 arc-45 44.34,28.73 36.39,28.73 arc-90 35.88,29.23 35.88,29.53 | 54.61,38.73 56.33,40.45 arc-45 56.78,40.64 U$18.1 | v53.34,36.2 52.7,36.83 | v55.25,38.1 54.61,38.73 | 54.61,38.73 52.7,36.83
  Route15 0.61: 35.88,29.53 35.88,44.98 arc45 35.58,45.7 34,47.28 arc45 33.28,47.57 31.75,47.57 arc-90 31.12,48.21 PWR-NW.1
  Bottom 0.203: v53.34,36.2
  Bottom 0.457: C1.1 v53.34,36.2 | C2.1 v55.25,38.1
  Bottom 0.508: v55.25,38.1
CSO_SE_V  (via drill 0.38)
  Top 0.508: v66.67,19.05 C8'.1 | v68.58,20.95 C7'.1
  Route15 0.457: 69.22,20.32 77.13,28.24 arc-45 77.58,28.42 85.53,28.42 arc-90 86.04,27.91 86.04,27.62 | U$21.1 65.14,16.51 arc45 65.59,16.7 67.31,18.41 | v66.67,19.05 67.31,18.41 | v68.58,20.95 69.22,20.32 | 67.31,18.41 69.22,20.32
  Route15 0.61: 86.04,27.62 86.04,12.17 arc45 86.34,11.45 87.92,9.87 arc45 88.64,9.58 90.17,9.58 arc-90 90.81,8.94 PWR-SE.1
  Bottom 0.203: v66.67,19.05
  Bottom 0.457: v66.67,19.05 C8'.1 | v68.58,20.95 C7'.1
  Bottom 0.508: C8'.1 | C7'.1
CSO_SW_V  (via drill 0.25, 0.25 pad 0.25)
  Top 0.406: v55.25,19.05 C6.1 | v53.34,20.95 C5'.1
  Route2 0.203: 60.56,1.35 60.56,1.45 | 60.56,1.45 arc180 60.56,2.36 | 60.56,2.36 60.56,2.46 | 60.56,2.36 arc180 60.56,1.45 | 60.56,5.89 arc180 60.56,6.81 | 60.56,6.81 arc180 60.56,5.89 | 60.56,10.12 arc180 60.56,11.03 | 60.56,11.03 arc180 60.56,10.12 | 60.56,5.79 60.56,5.89 | 60.56,6.81 60.56,6.91 | 60.56,10.01 60.56,10.12 | 60.56,11.03 60.56,11.14
  Route2 0.406: 60.56,2.46 60.56,5.79 | 60.56,6.91 60.56,10.01 | 60.56,11.14 60.56,12.19 arc44 60.38,12.63 59.87,13.15 arc45 59.87,13.16 57.47,15.56 | 57.47,15.56 54.61,18.41 | 54.61,18.41 52.97,20.05 arc-90 52.97,20.59 v53.34,20.95 | 54.61,18.41 v55.25,19.05 | U$22.1 57.47,15.56 | 60.56,1.35 60.56,0.94 arc90 60.94,0.56 61.11,0.56 | 76.05,0.56 76.18,0.56 arc90 76.56,0.94 v76.56,1.27
  Route2 0.61: 76.05,0.56 61.11,0.56
  Bottom 0.406: v53.34,20.95 53.85,21.46 C5'.1 | v55.25,19.05 55.88,19.68 C6.1 | ZED1.112 v76.56,1.27
DONE_E  (via drill 0.25)
  Top 0.203: v101.31,25.12 arc45 101.38,24.95 102.64,23.68 arc45 103.09,23.49 106.78,23.49 arc-45 107.23,23.31 107.77,22.76 arc45 108.22,22.57 U5.76
  Bottom 0.203: v101.31,25.12 U4.22
DONE_W  (via drill 0.25)
  Top 0.203: v20.61,32.03 arc45 20.54,32.2 19.28,33.47 arc45 18.83,33.66 15.14,33.66 arc-45 14.69,33.84 14.15,34.39 arc45 13.7,34.58 U9.76
  Bottom 0.203: v20.61,32.03 U3.22
E_EN  (via drill 0.25)
  Top 0.203: X-EAST.14 80.89,39.33 | 80.89,39.33 arc45 81.34,39.51 | 81.34,39.51 v81.91,40.07 | 80.89,39.33 arc45 81.34,39.51 | v91.44,41.91 91.94,41.91 arc-45 92.39,41.72 92.65,41.46 arc45 93.1,41.27 96.42,41.27 arc-90 97.56,40.13 97.56,38.92 arc45 97.75,38.47 97.87,38.34 arc-45 98.06,37.89 U5.20
  Bottom 0.203: v81.91,40.07 82.48,40.07 arc45 82.93,40.25 83.38,40.71 arc-45 83.83,40.89 84.82,40.89 arc45 85.27,41.08 85.28,41.09 arc-45 85.72,41.27 89.78,41.27 arc45 90.23,41.46 90.49,41.72 arc-45 90.94,41.91 v91.44,41.91
E_I2C_V  (via drill 0.25)
  Top 0.203: X-EAST.11 84.84,39.83 | X-EAST.13 84.71,39.33 | 84.84,39.83 84.84,39.4 84.71,39.53 v84.71,39.58 | 84.71,39.33 v84.71,39.58 | v84.71,39.58 84.71,39.83 | 84.71,39.33 84.58,39.33 84.58,39.83 84.71,39.83 | 84.71,39.83 84.84,39.83
  Route2 0.508: v84.71,39.58 arc45 85.14,39.75 85.49,40.1 arc45 85.67,40.55 85.67,44.14 arc-45 85.86,44.59 89.35,48.07 arc45 89.53,48.52 89.53,50.54 arc-45 89.72,50.99 PWR-NE.1
E_SCK  (via drill 0.25)
  Top 0.203: X-EAST.12 79.38,39.83 | 79.38,39.83 arc-45 78.94,40.01 | 79.38,39.83 arc-45 78.94,40.01 | 78.94,40.01 v78.87,40.08 | v97.56,35.02 U5.21
  Route2 0.203: v90.81,42.55 91.3,42.55 arc-45 91.75,42.36 92.65,41.46 arc45 93.1,41.27 96.42,41.27 arc-90 97.56,40.13 97.56,38.92 arc45 97.75,38.47 97.87,38.34 arc-45 98.06,37.89 98.06,36.53 arc-45 97.95,36.26 97.67,35.99 arc45 97.56,35.72 v97.56,35.02
  Bottom 0.203: 79.18,40.39 arc-45 79.63,40.58 | v78.87,40.08 79.18,40.39 | 79.18,40.39 arc-45 79.63,40.58 | 90.79,42.53 v90.81,42.55 90.71,42.55 arc45 90.44,42.43 89.97,41.97 arc-45 89.53,41.78 85.38,41.78 arc-45 85.11,41.89 85.08,41.92 arc45 84.81,42.04 84.61,42.04 arc45 84.34,41.92 83.93,41.51 arc-45 83.66,41.4 83.58,41.4 arc45 83.13,41.22 82.67,40.76 arc-45 82.22,40.58 79.63,40.58
E_SCL
  Top 0.203: 87.5,38.83 X-EAST.15 87.76,38.83 arc-90 88.9,37.68 88.9,32.01 arc45 89.09,31.56 90.89,29.76 arc45 91.34,29.57 U5.36
E_SDA
  Top 0.203: 87.28,38.33 X-EAST.17 87.63,38.33 arc-90 88.27,37.69 88.27,31.89 arc45 88.45,31.44 90.63,29.26 arc45 91.08,29.07 U5.37
E_SDI  (via drill 0.25)
  Top 0.203: X-EAST.16 81.14,38.83 arc45 81.59,39.01 v81.91,39.33 | v90.81,41.27 91.69,41.27 arc-45 92.13,41.09 92.4,40.83 arc45 92.85,40.64 95.43,40.64 arc-90 96.06,40 U5.24
  Bottom 0.203: v81.91,39.33 81.97,39.39 arc-45 82.42,39.58 83.64,39.58 arc45 84.08,39.76 84.27,39.95 arc-45 84.72,40.13 89.4,40.13 arc45 89.85,40.32 v90.81,41.27
E_SDO  (via drill 0.25)
  Top 0.203: X-EAST.18 81.4,38.33 | 81.4,38.33 arc45 81.85,38.51 | 81.85,38.51 v81.91,38.58 | 81.4,38.33 arc45 81.85,38.51 | v95.56,35.02 U5.25
  Route2 0.203: v91.44,40.64 95.43,40.64 arc-90 96.06,40 96.06,36.53 arc-45 95.95,36.26 95.67,35.99 arc45 95.56,35.72 v95.56,35.02
  Bottom 0.203: 85.28,39.44 85.11,39.26 arc-45 84.66,39.08 82.67,39.08 arc45 82.22,38.89 v81.91,38.58 | 85.28,39.44 arc-45 85.73,39.62 | 85.73,39.62 90.16,39.62 arc45 90.61,39.81 v91.44,40.64 | 85.28,39.44 arc-45 85.73,39.62
E_SPI_V  (via drill 0.25)
  Top 0.152: 84.71,37.33 84.84,37.33 84.84,37.47
  Top 0.203: X-EAST.19 84.84,37.83 84.84,38.55 84.71,38.55 | X-EAST.21 84.71,37.33 | 84.84,37.4 84.84,37.47 84.84,38.1 | 84.71,37.33 84.71,38.55 | 84.71,37.33 84.58,37.33 84.58,38.55 84.71,38.55 | 84.71,38.55 84.71,38.54 v84.71,38.42
  Route2 0.508: v84.71,38.42 85.14,38.42 arc45 85.59,38.6 85.72,38.73 86.5,39.56 arc43 86.68,40 86.68,43.55 arc-45 86.86,44 90.3,47.44 arc-45 90.75,47.62 91.18,47.62 arc45 91.63,47.81 91.89,48.07 arc45 92.08,48.52 92.08,50.54 arc-45 92.26,50.99 PWR-NE.3
E_VE_CV  (via drill 0.25)
  Top 0.152: X-EAST.90 v81.46,17.32
  Bottom 0.152: PB-SE.19 84.9,16.85 arc-45 84.63,16.97 84.44,17.16 arc45 84.17,17.27 81.51,17.27 v81.46,17.32
E_VE_OV  (via drill 0.25)
  Top 0.152: X-EAST.93 87.69,15.32 arc-45 87.87,15.25 89.19,13.93 arc45 89.37,13.85 v91.69,13.85
  Bottom 0.152: PB-SE.8 v91.69,13.85
E_VE_UV  (via drill 0.25)
  Top 0.152: X-EAST.91 87.83,15.82 arc-45 88.01,15.75 89.33,14.43 arc45 89.51,14.35 v91.31,14.35
  Bottom 0.152: PB-SE.10 v91.31,14.35
GND  (via drill 0.25, 0.41, 2.15 pad 2.3, 3.17 pad 4.5)
  Bottom 0.203: U3.25 v21.19,29.4 | v100.73,27.75 U4.25
  other vias: 81.91,8.89 81.91,3.81 40.01,8.89 40.01,3.81 81.91,6.35 40.01,6.35 81.96,50.8 81.96,53.34 81.91,48.26 77.15,25.4 75.88,24.13 77.79,24.13 76.52,22.86 75.25,21.59 73.98,20.32 72.71,19.05 74.61,22.86 73.34,21.59 72.07,20.32 74.61,19.05 75.88,20.32 77.15,21.59 78.42,22.86 76.45,26.61 75.25,25.4 73.98,24.13 72.71,22.86 71.44,21.59 70.17,20.32 68.9,19.05 67.63,17.78 66.36,16.51 65.09,15.24 63.82,13.97 62.61,12.76 61.47,11.62 63.18,11.43 64.45,12.7 65.72,13.97 66.99,15.24 68.26,16.51 77.6,27.75 77.79,20.32 76.52,19.05 75.25,17.78 73.98,16.51 73.34,17.78 71.44,17.78 70.8,19.05 74.61,15.24 72.71,15.24 72.07,16.51 70.17,16.51 70.8,15.24 71.44,13.97 73.34,13.97 74.96,11.77 72.56,11.77 72.56,10.57 70.16,10.57 70.17,12.7 67.76,11.77 67.76,10.57 68.26,12.7 46.96,12.97 68.9,15.24 69.53,13.97 67.63,13.97 66.36,12.7 65.09,11.43 62.96,10.57 65.36,10.57 70.16,11.77 60.56,10.57 77.15,17.78 78.42,19.05 75.25,13.97 69.53,17.78 74.96,12.97 74.96,10.57 78.11,26.35 77.6,29.4 76.45,30.54 75.25,31.75 73.98,33.02 72.71,34.29 71.44,35.56 70.17,36.83 68.9,38.1 67.63,39.37 66.36,40.64 65.09,41.91 63.82,43.18 77.15,31.75 75.88,33.02 74.61,34.29 73.34,35.56 72.07,36.83 70.8,38.1 68.26,40.64 66.99,41.91 65.72,43.18 62.96,45.38 68.9,41.91 67.63,43.18 70.8,41.91 54.96,46.58 72.56,42.98 72.56,44.17 74.96,41.77 74.96,45.38 74.96,46.58 72.71,38.1 73.34,39.37 74.61,38.1 75.88,36.83 77.15,35.56 78.42,34.29 73.98,36.83 75.25,35.56 76.52,34.29 77.79,33.02 78.11,30.8 75.25,39.37 76.52,38.1 77.79,36.83 75.88,40.64 77.15,39.37 77.79,40.64 77.36,41.77 77.36,42.98 77.36,44.17 77.36,45.38 77.36,46.58 70.16,44.17 62.96,46.58 74.96,44.17 74.96,42.98 72.56,46.58 70.16,46.58 52.56,46.58 70.17,40.64 72.07,40.64 71.44,39.37 72.71,41.91 69.53,39.37 70.16,45.38 65.36,44.17 67.76,45.38 67.76,46.58 65.36,45.38 62.61,44.39 61.47,45.53 60.45,45.53 59.31,44.39 58.1,43.18 56.83,41.91 55.56,40.64 54.29,39.37 53.02,38.1 51.75,36.83 50.48,35.56 49.21,34.29 47.94,33.02 46.67,31.75 45.47,30.54 44.32,29.4 44.32,27.75 45.47,26.61 46.67,25.4 47.94,24.13 49.21,22.86 50.48,21.59 51.75,20.32 53.02,19.05 54.29,17.78 55.56,16.51 56.83,15.24 58.1,13.97 59.31,12.76 57.47,12.7 56.2,13.97 54.93,15.24 53.66,16.51 51.12,19.05 49.85,20.32 47.94,20.32 46.04,20.32 44.13,20.32 48.58,21.59 46.67,21.59 44.77,21.59 47.31,22.86 45.4,22.86 43.5,22.86 46.04,24.13 44.13,24.13 44.77,25.4 43.5,26.35 43.5,24.77 49.21,19.05 47.31,19.05 45.4,19.05 43.5,19.05 48.58,17.78 46.67,17.78 44.77,17.78 46.04,16.51 53.02,15.24 47.31,15.24 73.98,40.64 57.36,46.58 70.16,42.98 72.56,45.38 67.76,44.17 74.96,50.8 72.56,50.8 70.16,50.8 67.76,50.8 65.36,50.8 62.96,50.8 60.56,50.8 46.89,50.8 77.36,50.8 78.42,45.72 80.01,44.77 80.01,46.67 81.03,45.72 83.82,38.1 82.23,36.51 82.23,35.24 82.23,33.97 82.23,32.38 82.23,30.8 82.23,26.35 82.23,24.77 82.23,23.18 82.23,21.91 82.55,38.1 78.11,10.48 79.06,11.43 80.01,12.38 80.01,10.48 81.91,12.38 80.96,11.43 81.91,44.77 72.07,12.7 76.16,6.35 72.56,6.35 70.16,6.35 67.76,6.35 65.77,6.35 60.56,6.35 54.96,6.35 46.96,6.35 44.56,6.35 52.56,6.35 65.36,46.58 57.47,44.45 55.56,44.45 53.66,44.45 51.75,44.45 56.2,43.18 54.29,43.18 54.93,41.91 53.02,41.91 53.66,40.64 51.12,38.1 49.21,38.1 47.31,38.1 45.4,38.1 43.5,38.1 49.85,36.83 47.94,36.83 46.04,36.83 44.13,36.83 48.58,35.56 46.67,35.56 44.77,35.56 47.31,34.29 45.4,34.29 43.5,34.29 46.04,33.02 44.13,33.02 44.77,31.75 50.48,39.37 49.85,40.64 50.48,43.18 49.21,41.91 48.58,39.37 48.58,43.18 50.56,46.58 49.85,44.45 51.12,41.91 51.75,40.64 47.31,41.91 47.94,40.64 52.39,39.37 52.39,43.18 52.56,45.38 48.96,44.17 46.96,44.17 46.67,43.18 45.4,41.91 44.13,40.64 46.04,40.64 44.77,39.37 46.67,39.37 43.5,30.8 52.39,13.97 48.96,12.97 46.96,10.57 51.12,15.24 50.48,13.97 50.56,11.77 51.75,16.51 49.21,15.24 47.94,16.51 49.85,16.51 52.39,17.78 50.48,17.78 52.56,12.97 52.56,10.57 54.96,12.97 54.29,13.97 50.56,12.97 46.96,14.17 50.56,10.57 52.56,11.77 54.96,11.77 56.96,11.77 54.96,10.57 56.96,10.57 58.74,11.43 46.96,11.77 44.56,15.38 48.96,11.77 44.56,14.17 44.13,16.51 39.69,33.97 39.69,35.24 39.69,32.38 39.69,30.8 39.69,26.35 39.69,23.18 39.69,21.91 39.69,20.64 39.69,24.77 37.78,21.91 53.76,55.88 51.36,55.88 56.16,55.88 53.76,1.27 56.16,1.27 51.36,1.27 107.95,3.81 13.97,3.81 13.97,53.34 107.95,53.34 48.96,10.57 72.56,1.9 74.96,1.9 70.16,1.9 67.76,1.9 65.36,1.9 62.96,1.9 60.56,1.9 46.96,1.9 44.56,1.9 74.96,55.25 72.56,55.25 70.16,55.25 67.76,55.25 65.36,55.25 62.96,55.25 60.56,55.25 46.96,55.25 77.36,55.25 54.96,1.9 52.56,1.9 52.56,55.25 54.96,55.25 40.01,53.34 40.01,48.26 40.01,50.8 39.69,29.4 39.69,27.75 82.23,29.4 82.23,27.75 39.69,36.51 39.69,38.1 37.78,38.1 37.78,35.24 41.91,44.77 40.01,44.77 37.47,44.77 38.1,16.83 38.1,19.05 39.37,15.68 38.1,39.37 39.37,39.37 76.52,15.24 75.88,16.51 77.79,16.51 78.42,38.1 83.82,40.32 82.55,41.47 84.14,35.24 39.37,19.05 38.1,24.77 38.1,32.38 38.1,30.8 37.78,29.4 37.78,27.75 38.1,26.35 37.78,23.18 37.78,33.97 84.14,33.97 83.82,32.38 83.82,30.8 84.14,29.4 84.14,27.75 83.82,26.35 83.82,24.77 84.14,23.18 84.45,12.38 48.96,14.17 58.56,10.57 44.56,12.97 44.56,11.77 44.56,10.57 48.96,46.58 48.96,45.38 50.56,45.38 54.93,45.72 56.83,45.72 58.74,45.72 46.96,46.58 46.96,44.97 59.58,46.58 54.96,50.8 52.56,50.8 45.76,50.8 62.97,6.35 41.91,12.38 42.55,11.75 43.18,11.11 40.01,12.38 44.16,50.8 43.36,46.58 44.96,46.58 45.76,44.97 41.76,46.58 9.52,36.33 9.52,34.33 82.23,20.64 82.23,19.05 84.14,19.05 84.14,21.91 83.82,17.78 82.23,17.78 9.52,23.49 9.52,21.91 9.52,17.78 9.52,42.33 9.52,25.72 10.8,50.8 9.52,52.07 13.34,49.53 15.24,49.53 17.15,51.12 15.24,48.26 19.05,53.02 20.95,54.61 22.86,54.61 24.77,54.61 26.67,54.61 28.58,54.61 30.48,54.61 32.39,54.61 34.29,54.61 34.29,53.34 34.29,55.88 36.2,55.88 36.2,54.61 36.2,52.7 38.1,54.61 38.1,55.88 40.01,54.61 40.01,55.88 41.91,54.61 41.91,55.88 45.09,55.25 38.1,52.7 32.39,55.88 30.48,55.88 28.58,55.88 26.67,55.88 24.77,55.88 22.86,55.88 20.95,55.88 19.05,54.93 20.95,53.02 17.15,53.02 9.52,49.53 9.52,46.67 11.43,49.53 17.15,49.21 19.05,51.12 9.52,7.82 9.52,5.82 15.24,7.62 20.95,2.54 22.86,2.54 26.67,2.54 28.58,2.54 30.48,2.54 32.39,2.54 34.29,2.54 36.2,2.54 38.1,2.54 40.01,2.54 40.01,1.27 38.1,1.27 36.2,1.27 34.29,1.27 32.39,1.27 30.48,1.27 28.58,1.27 26.67,1.27 24.77,1.27 22.86,1.27 20.95,1.27 19.05,2.22 17.15,4.13 41.91,1.27 34.29,3.81 36.2,4.45 38.1,4.45 9.52,10.07 9.52,13.82 19.53,29.4 19.53,27.75 21.19,27.75 58.42,34.29 57.15,33.02 62.87,22.23 64.77,24.13 56.52,32.38 65.41,24.77 59.05,34.92 63.5,22.86 5.08,21.82 5.08,19.82 5.08,13.82 5.08,11.82 5.08,9.82 5.08,7.82 5.08,5.82 5.08,34.33 5.08,36.33 5.08,38.33 5.08,40.33 5.08,42.33 5.08,48.33 5.08,50.33 11.43,48.26 13.34,48.26 44.77,43.18 77.15,13.97 13.34,8.89 17.15,7.94 15.24,8.89 19.05,6.03 20.95,4.13 9.52,40.33 9.52,38.33 13.34,7.62 19.05,4.13 17.15,6.03 24.77,2.54 24.77,3.81 22.86,3.81 26.67,3.81 9.52,11.82 5.08,44.97 5.08,54.12 5.08,25.62 5.08,16.48 9.52,54.29 91.44,21.91 91.44,20.64 91.12,19.05 89.53,21.91 92.71,35.56 90.81,36.51 90.81,35.24 89.53,37.78 89.53,35.24 93.66,36.51 89.53,36.51 89.53,19.37 92.08,18.1 89.53,20.64 11.43,9.84 11.43,7.94 11.43,6.03 82.23,16.38 83.82,16.38 87.63,26.04 88.9,24.77 34.29,37.78 34.29,36.51 34.29,35.24 34.29,33.97 34.29,23.18 34.29,19.37 34.29,21.91 34.29,20.64 87.63,37.78 87.63,36.51 87.63,35.24 87.63,21.91 87.63,20.64 87.63,19.37 87.63,24.13 94.93,37.78 96.84,38.42 93.98,39.05 93.03,40 90.81,37.78 92.71,37.78 94.93,40 94.62,19.68 96.52,17.78 95.57,18.73 94.93,15.24 96.84,15.24 93.98,18.1 92.71,19.37 92.71,21.59 9.52,20 83.82,14.99 82.55,14.99 39.37,40.77 38.1,40.77 38.1,42.16 39.37,42.16 17.26,37.58 18.36,37.58 19.36,37.58 20.36,37.58 21.61,37.58 22.86,37.58 15.46,37.58 24.13,37.58 11.43,40.33 11.43,37.15 11.43,34.93 12.7,36.2 13.97,37.47 13.46,39.05 15.75,39.05 17.27,39.05 18.92,39.05 20.32,39.05 21.59,39.05 22.86,39.05 24.13,39.05 16,40.33 12.7,40.33 14.22,40.33 17.65,40.33 19.18,40.33 20.83,40.33 22.61,40.33 24.13,40.33 12.7,41.91 14.22,41.91 16,41.91 17.65,41.91 19.69,41.91 21.59,41.91 23.49,41.91 25.91,40.33 25.91,39.05 27.62,38.74 27.62,40.33 27.62,41.91 25.91,41.91 25.7,37.58 32.39,37.78 32.39,36.51 32.39,35.24 32.39,33.97 28.26,36.2 29.85,41.59 31.12,39.05 29.53,36.83 27.3,37.15 28.58,37.78 28.58,39.69 28.58,41.59 29.85,38.42 29.85,45.09 28.58,45.09 30.48,46.04 28.58,46.99 32.39,48.26 34.92,48.26 35.56,46.99 37.78,47.95 28.58,42.86 11.43,39.05 11.43,41.91 13.34,20.32 12.06,21.59 31.12,37.15 30.48,35.88 29.21,35.24 30.48,33.98 15.24,16.83 17.15,16.83 19.37,16.83 21.27,16.83 15.24,15.56 17.15,15.24 19.37,15.24 21.27,15.24 23.18,16.83 23.18,15.24 13.65,16.83 13.34,15.24 13.78,18.1 15.56,18.1 17.46,18.1 19.37,18.1 21.27,18.1 23.18,18.1 15.24,19.68 16.51,19.68 18.29,19.68 19.37,19.68 20.95,19.68 22.86,19.68 25.08,19.68 25.72,18.1 25.72,16.83 25.72,15.24 102.39,27.75 102.39,29.4 100.73,29.4 103.56,19.57 102.56,19.57 101.56,19.57 100.31,19.57 99.06,19.57 97.79,19.57 109.22,20.95 104.65,18.09 103,18.09 101.6,18.09 100.33,18.09 99.06,18.09 97.79,18.09 105.92,16.82 104.27,16.82 102.74,16.82 101.09,16.82 99.31,16.82 97.79,16.82 107.7,15.24 105.92,15.24 104.27,15.24 102.23,15.24 100.33,15.24 98.43,15.24 93.66,20.63 108.59,36.83 106.68,40.32 104.78,40.32 102.55,40.32 100.65,40.32 106.68,41.59 104.78,41.91 102.55,41.91 100.65,41.91 98.74,40.32 98.74,41.91 108.27,40.32 108.59,41.91 108.14,39.05 106.36,39.05 104.46,39.05 102.55,39.05 100.65,39.05 98.74,39.05 106.68,37.47 105.41,37.47 103.63,37.47 102.55,37.47 100.97,37.47 99.06,37.47 94.93,16.83 96.84,41.91 94.93,41.91 93.03,41.91 93.03,15.24 93.03,16.83 96.52,16.83 96.84,40 37.78,36.51 37.78,20.64 84.14,36.51 84.14,20.64 40.32,19.37 81.6,37.78 106.06,24.07 104.14,32.38 106.06,26.04 15.86,33.08 15.86,31.12 17.78,24.77 11.11,26.99 11.11,25.72 11.43,20 11.43,18.1 11.11,16.19 11.43,23.49 32.39,23.18 32.39,21.91 32.39,20.64 32.39,19.37 30.48,23.18 30.48,21.27 30.48,19.37 30.48,17.46 27.62,18.41 28.58,17.46 28.58,15.56 28.58,21.27 27.3,20 28.58,19.37 27.62,16.83 27.62,15.24 91.44,30.48 87.63,33.97 90.81,34.29 90.81,33.02 92.39,39.37 90.17,39.05 87.63,40.64 92.08,26.67 90.81,25.4 91.44,28.57 64.77,33.02 63.5,34.29 62.87,34.92 65.41,32.38 57.15,24.13 58.42,22.86 59.05,22.23 56.52,24.77 96.84,33.34 98.74,31.43 101.92,33.34 97.47,30.8 25.08,23.81 23.18,25.72 24.45,26.35 20,23.81 17.78,26.04 15.88,29.53 23.18,31.43 106.06,27.62 104.16,31.11 98.76,25.72 43.5,29.4 43.5,27.75 38.73,29.4 38.73,27.75 34.29,29.53 34.29,30.8 83.19,29.4 83.19,27.75 87.63,27.62 78.42,29.4 78.42,27.81 89.53,33.02 8.89,1.27 5.08,1.27 5.08,55.88 1.91,44.45 9.52,30.48 8.89,55.88 8.26,54.61 1.27,55.88 1.27,1.27 8.26,44.45 8.26,15.88 89.53,8.89 93.34,10.16 109.86,35.56 22.86,53.34 24.77,53.34 26.67,53.34 29.85,53.34 29.85,3.81 32.39,3.81 32.39,53.34 1.91,15.88 29.85,48.26 87,8.89 92.08,8.89 60.96,13.97 60.96,43.18 46.36,28.57 75.56,28.57
  pour Top (rank 3): 111.76,0 0,0 0,57.15 111.76,57.15
  pour Bottom (rank 3): 111.76,0 0,0 0,57.15 111.76,57.15
  pour Route2 (rank 3): 111.76,0 0,0 0,57.15 111.76,57.15
  pour Route15 (rank 3): 111.76,0 0,0 0,57.15 111.76,57.15
INITN_E  (via drill 0.25)
  Top 0.203: v101.81,25.55 arc45 101.88,25.4 102.52,24.76 arc45 102.97,24.57 106.4,24.57 arc-45 106.85,24.39 107.97,23.26 arc45 108.42,23.07 U5.77
  Bottom 0.203: v101.81,25.55 U4.21
INITN_W  (via drill 0.25)
  Top 0.203: v20.11,31.6 arc45 20.04,31.75 19.4,32.39 arc45 18.95,32.58 15.52,32.58 arc-45 15.07,32.76 13.95,33.89 arc45 13.5,34.08 U9.77
  Bottom 0.203: v20.11,31.6 U3.21
JTAG_V  (via drill 0.25)
  Top 0.152: 37.08,19.75 37.34,19.75 37.34,19.68
  Top 0.203: X-WEST.19 37.08,19.32 37.08,18.6 37.21,18.6 | X-WEST.21 37.21,19.82 | 37.08,19.75 37.08,19.05 | 37.21,19.82 37.21,18.6 | 37.21,19.82 37.34,19.82 37.34,19.68 37.34,18.6 37.21,18.6 | 37.21,18.6 37.21,18.61 v37.21,18.73
  Route2 0.457: 36.2,18.41 36.33,18.55
  Route2 0.508: 36.2,18.41 35.41,17.59 arc43 35.24,17.15 35.24,13.6 arc-45 35.06,13.15 31.62,9.71 arc-45 31.17,9.52 30.74,9.52 arc45 30.29,9.34 30.03,9.08 arc45 29.85,8.63 29.85,6.61 arc-45 29.66,6.16 PWR-SW.3 | 36.33,18.55 arc-45 36.78,18.73 v37.21,18.73
JTAGENB_E  (via drill 0.25)
  Top 0.203: v103.51,26.62 106.35,26.62 arc-45 106.8,26.43 107.47,25.76 arc45 107.92,25.57 U5.82
  Bottom 0.203: U4.19 v103.51,26.62
JTAGENB_W  (via drill 0.25)
  Top 0.203: v18.41,30.53 15.57,30.53 arc-45 15.12,30.72 14.45,31.39 arc45 14,31.57 U9.82
  Bottom 0.203: U3.19 v18.41,30.53
JX1_00_N  (via drill 0.25)
  Top 0.152: v75.76,54.23 75.9,54.09 arc-45 76.01,53.82 76.01,49.77 arc45 76.19,49.32 82.85,42.67 arc-45 83.03,42.22 83.03,36.58 arc90 83.88,35.73 84.94,35.73 85.04,35.83 X-EAST.27
  Bottom 0.152: ZED1.13 v75.76,54.23
JX1_00_P  (via drill 0.25)
  Top 0.152: v76.56,54.23 76.42,54.09 arc45 76.31,53.82 76.31,49.9 arc45 76.5,49.45 83.15,42.79 arc-45 83.34,42.34 83.34,36.58 arc90 83.88,36.03 84.76,36.03 84.98,36.25 arc-45 85.16,36.33 X-EAST.25
  Bottom 0.152: ZED1.11 v76.56,54.23
JX1_01_N
  Bottom 0.152: ZED1.14 75.76,47.73 arc45 75.83,47.55 75.93,47.45 arc-45 76.01,47.27 76.01,41.52 arc45 76.19,41.07 80.08,37.18 arc45 80.53,36.99 90.92,36.99 arc45 91.37,37.18 93.73,39.54 arc45 93.91,39.98 93.91,40.97 arc-90 94.06,41.12 94.08,41.12 arc90 94.23,41.27 94.23,41.28 arc90 94.08,41.44 94.06,41.44 arc-90 93.91,41.59 93.91,41.6 arc-90 94.06,41.75 94.08,41.75 arc90 94.23,41.91 94.23,41.92 arc90 94.08,42.07 94.06,42.07 arc-90 93.91,42.23 93.91,42.24 arc-90 94.06,42.39 94.08,42.39 arc90 94.23,42.54 94.23,42.56 arc90 94.08,42.71 94.06,42.71 arc-90 93.91,42.86 93.91,43.06 arc-45 94.1,43.51 HDR-NE.16
JX1_01_P
  Bottom 0.152: ZED1.12 76.56,47.73 arc-45 76.49,47.55 76.39,47.45 arc45 76.31,47.27 76.31,41.64 arc45 76.5,41.19 80.2,37.49 arc45 80.65,37.3 90.8,37.3 arc45 91.25,37.49 93.42,39.66 arc45 93.61,40.11 93.61,44.76 arc-45 93.79,45.21 HDR-NE.15
JX1_02_N  (via drill 0.25)
  Top 0.152: v73.36,54.23 73.5,54.09 arc-45 73.61,53.82 73.61,42.01 arc45 73.79,41.56 78.25,37.11 arc45 78.69,36.92 78.93,36.92 arc-45 78.98,36.9 arc45 79.16,36.83 X-EAST.24
  Bottom 0.152: ZED1.19 v73.36,54.23
JX1_02_P  (via drill 0.25)